# EAGLE design bluetooth-buddy (EAGLE 7.7.0)
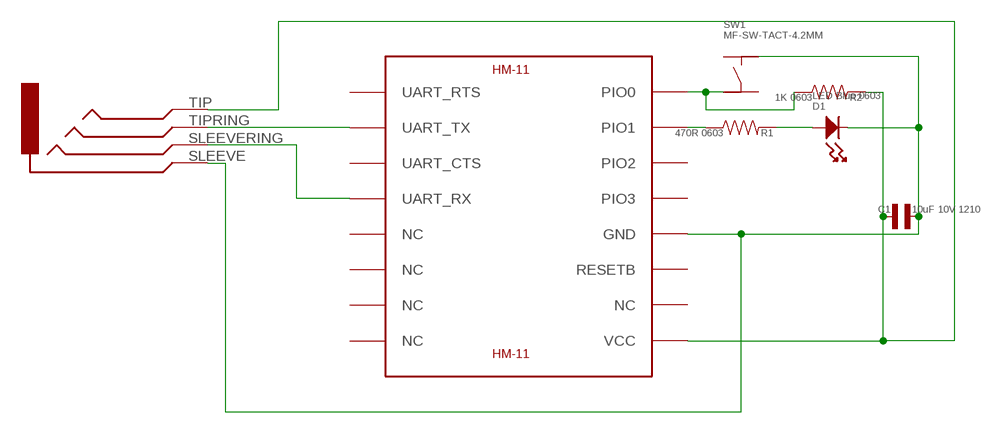
[diagram p0: schematic, sheet 1]

## Parts
C1  10uF 10V 1210  CAPACITOR_NP_1210  [C1210]
D1  LED Blue 0603  LED_SINGLE-0603  [LED0603]
J1  54-00035  TRRS_JACK  [54-00035]
R1  470R 0603  RESISTOR_0603  [R0603]
R2  1K 0603  RESISTOR_0603  [R0603]
SW1  MF-SW-TACT-4.2MM  TACT_4.2MM  [TACT4.2MM]
U$1  HM-11  [HM-11]

## Nets
GND: C1.P$1 D1.CATHODE J1.SLEEVE(S) SW1.P$2 U$1.GND
N$1: J1.TIPRING(RT) U$1.UART_TX
N$2: J1.SLEEVERING(RS) U$1.UART_RX
N$4: R1.P$1 U$1.PIO1
N$5: R2.P$1 SW1.P$3 U$1.PIO0
N$6: D1.ANODE R1.P$2
N$7: C1.P$2 J1.TIP(T) R2.P$2 U$1.VCC
Unconnected: SW1.P$1 SW1.P$4 U$1.NC@5(NC) U$1.NC@6(NC) U$1.NC@7(NC) U$1.NC@8(NC) U$1.NC@10(NC) U$1.PIO2 U$1.PIO3 U$1.RESETB U$1.UART_CTS U$1.UART_RTS

## Library data of the parts
C1 = MF_Passives:CAPACITOR_NP: Library: MF_Passives Description: Device for Non-Polarized Capacitors. Manufacture part number (MPN) can be added via Attributes. Check https://factory.macrofab.com/parts for the house parts list.; POPULATE: 1
D1 = MF_LEDs:LED_SINGLE: Library: MF_LEDs Description: Device for Single LED Packages. Manufacture part number (MFG#) can be added via Attributes.; HOUSEPART: NO; POPULATE: 1
J1 = sonik:TRRS_JACK
R1 R2 = MF_Passives:RESISTOR: Library: MF_Passives Description: Device for Resistors. Manufacture part number (MPN), Voltage, Tolerance, and Wattage Rating can be added via Attributes. Check https://factory.macrofab.com/parts for the house parts list.; POPULATE: 1
SW1 = MF_Switches:TACT: Library: MF_Switches Description: Device for Tact Switches. Manufacture part number (MFG#) can be added via Attributes.; HOUSEPART: YES; MPN: MF-SW-TACT-4.2MM; POPULATE: 1; URL: https://factory.macrofab.com/part/MF-SW-TACT-4.2MM
U$1 = hm-11:HM-11: JNHuaMao HM-11 Bluetooth 4.0 Transceiver based on TI CC2540/CC2541

## Board
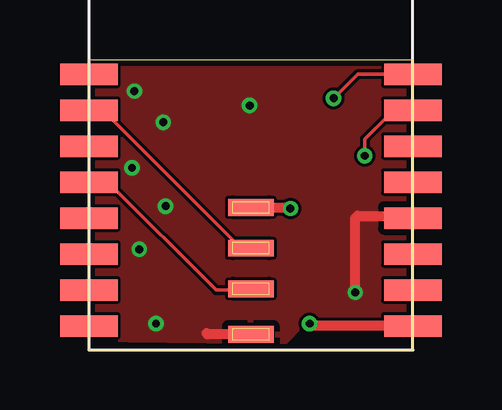
[diagram p1: board, top side]
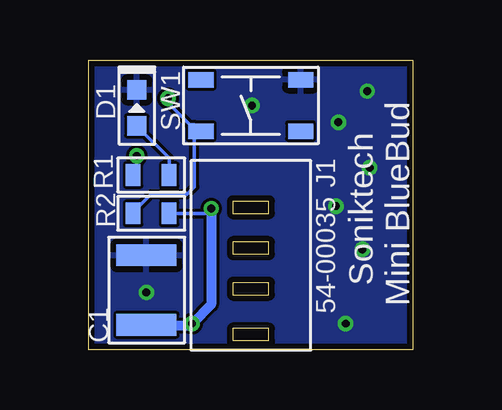
[diagram p2: board, bottom side, seen from below]

Size 13.5 x 12.1 mm. Coordinates in mm from the lower left corner, seen from the top.
Outline: 0,0 13.5,0 13.5,12.1 0,12.1 0,0
Copper layers (1*16): Top 0.035mm / dielectric 1.5mm / Bottom 0.035mm
Design rules "MF_Standard_2_Layer": minimum track width 5mil, minimum drill 12mil, track to track 5mil, track to pad 5mil, pad to pad 5mil, via to via 5mil, smd to smd 0mil, copper to edge 10mil, drill to drill 10mil, minimum pad ring 6mil, minimum via ring 6mil, stop-mask expansion 2mil, vias tented up to drill 25mil, thermal gap 10mil

### Footprints (pad centres in the part's own frame; a part is rotated, then mirrored left to right if it is on the bottom)
C1210 = smd 0.9 x 2.5: P$1 -1.45,0; P$2 1.45,0
LED0603 = smd 0.8 x 0.8: ANODE 0.75,0; CATHODE -0.75,0
54-00035 = smd 1.9 x 0.7 bottom: SLEEVE 0,0.65; SLEEVERING 0,2.55; TIP 0,5.95; TIPRING 0,4.25
R0603 = smd 0.6 x 0.9: P$1 -0.75,0; P$2 0.75,0
TACT4.2MM = smd 1.05 x 0.65: P$1 -2.075,1.075; P$2 2.075,1.075; P$3 -2.075,-1.075; P$4 2.075,-1.075
HM-11 = smd 2.4 x 0.9: GND 6.5,0; NC@5 -7,0; NC@6 -7,-1.5; NC@7 -7,-3; NC@8 -7,-4.5; NC@10 6.5,-3; PIO0 6.5,6; PIO1 6.5,4.5; PIO2 6.5,3; PIO3 6.5,1.5; RESETB 6.5,-1.5; UART_CTS -7,3; UART_RTS -7,6; UART_RX -7,1.5; UART_TX -7,4.5; VCC 6.5,-4.5

### Placement (x,y rotation side)
C1  11.1,2.5 270 bottom
D1  11.5,10.1 270 bottom
J1  6.75,0 0 bottom
R1  10.9,7.3 0 bottom
R2  10.9,5.7 0 bottom
SW1  6.75,10.2 0 bottom
U$1  7,5.5 0 top

### Tracks (layer width: path | path; a pad name or v marks a point on that pad's centre or on a via)
GND  (via drill 0.33)
  Top 0.406: J1.SLEEVE 4.95,0.65 4.9,0.7 | v11.1,2.4 11.1,5.5 11.2,5.6 13.4,5.6 U$1.GND
  other vias: 1.8,7.6 3.2,6 2.1,4.2 1.9,10.8 3.1,9.5 6.7,10.2 2.8,1.1
  pour Top: 0,0.4 8.2,0.3 8.9,1 12.8,1 13.4,0.4 13.5,0.4 13.5,12.1 0,12.1
  pour Bottom: 0,0 13.5,0 13.5,12.1 0,12.1
N$1
  Top 0.152: U$1.UART_TX 0.8,9.8 6.15,4.45 J1.TIPRING
N$2
  Top 0.152: U$1.UART_RX 0.8,7 5.3,2.5 6.2,2.5 6,2.7 6.6,2.7 J1.SLEEVERING
N$4  (via drill 0.33)
  Top 0.152: U$1.PIO1 12.7,10 11.5,8.8 v11.5,8.1
  Bottom 0.152: v11.5,8.1 11.5,7.45 R1.P$1
N$5  (via drill 0.33)
  Top 0.152: U$1.PIO0 11.2,11.5 v10.2,10.5
  Bottom 0.152: R2.P$1 11.65,5.75 10.9,6.5 9.4,6.5 9.1,6.8 9.1,8.85 SW1.P$3 9.1,9.4 9.3,9.4 10.2,10.3 v10.2,10.5
N$6
  Bottom 0.152: R1.P$2 10.15,8 D1.ANODE
N$7  (via drill 0.33)
  Top 0.406: J1.TIP 8.35,5.95 v8.4,5.9 | U$1.VCC 9.3,1 v9.2,1.1
  Bottom 0.152: R2.P$2 8.6,5.7 v8.4,5.9
  Bottom 0.406: v8.4,5.9 8.4,1.9 v9.2,1.1 9.3,1 11.05,1 C1.P$2

### Text on the board
bNames: Soniktech / Mini BlueBud